# Altium project MB1019.PrjPCB (part 2 of 2)

## Sheet CAN&Humidity_Sensor&HB_LED&IR.SchDoc
size A4; Revision: C.2
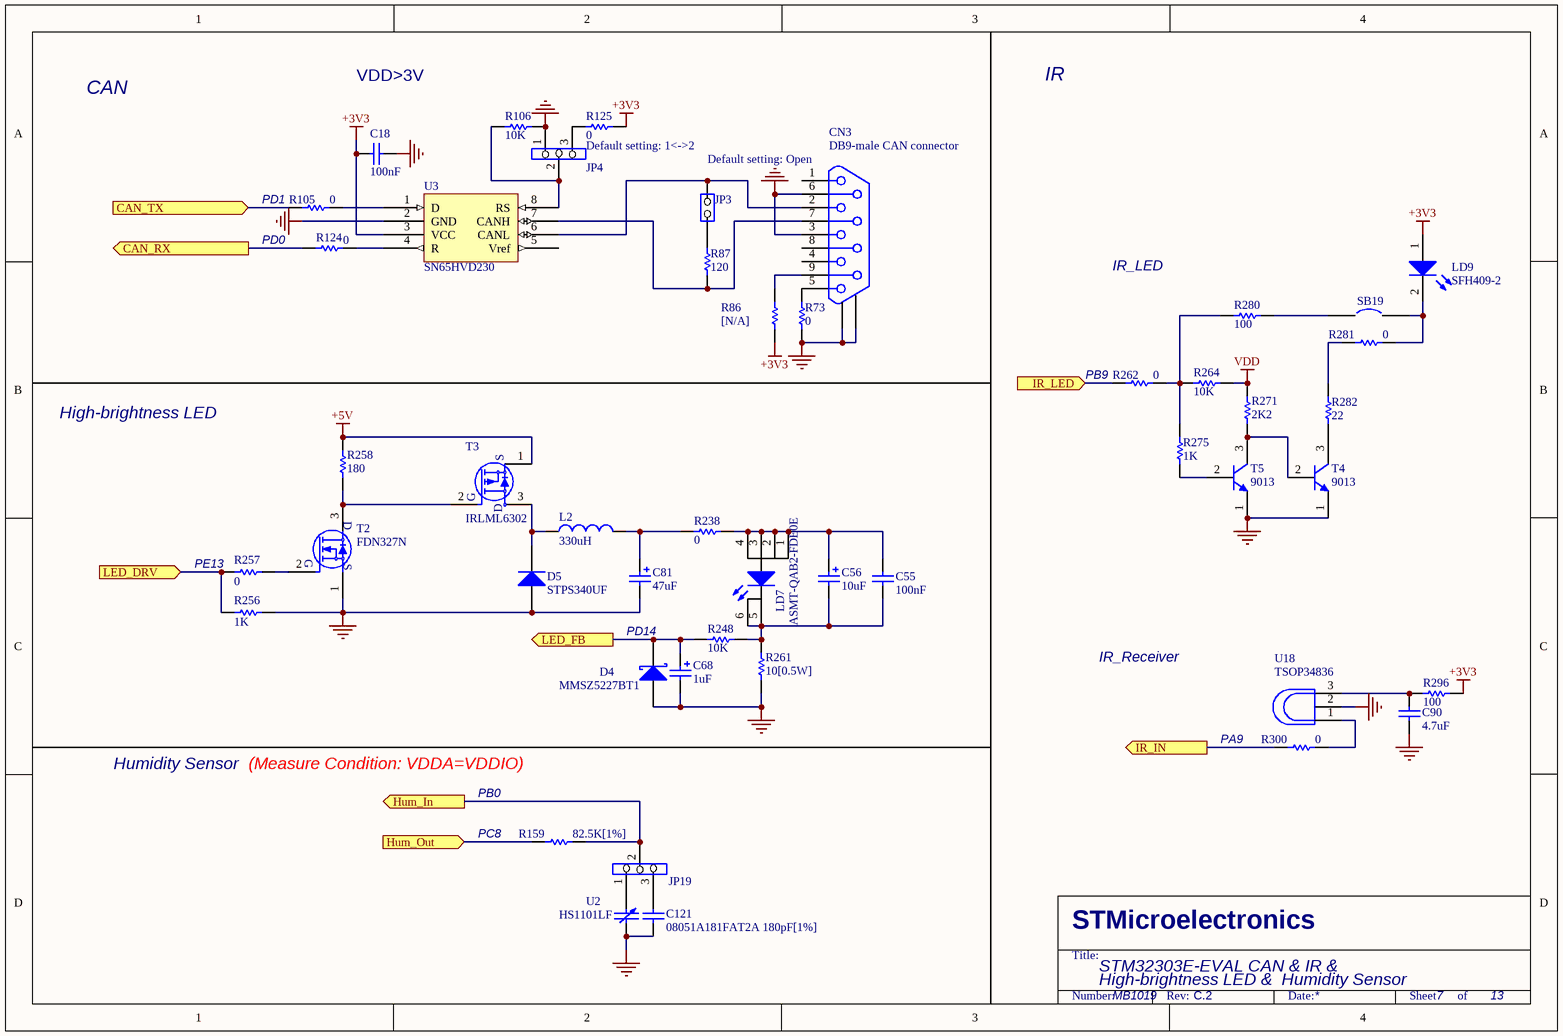
[diagram p6: CAN&Humidity_Sensor&HB_LED&IR.SchDoc]

### Parts
C18  100nF  [0603C]
C55  100nF  [0603C]
C56  10uF  [TAN-A]
C68  1uF  [TAN-A]
C81  47uF  [C200M]
C90  4.7uF  [0603C]
C121  08051A181FAT2A 180pF[1%]  [0805C]
CN3  DB9-male CAN connector  [DB9/M]
D4  MMSZ5227BT1  [SOD-123]
D5  STPS340UF  [SMB]
JP3  (no value)  [SIP2]
JP4  (no value)  [SIP3]
JP19  (no value)  [SIP3]
L2  330uH  [SLF10145]
LD7  ASMT-QAB2-FDE0E  [PLCC4]
LD9  SFH409-2  [D0.1L]
R73  0  [0603R]
R86  [N/A]  [0603R]
R87  120  [0603R]
R105  0  [0603R]
R106  10K  [0603R]
R124  0  [0603R]
R125  0  [0603R]
R159  82.5K[1%]  [0603R]
R238  0  [0603R]
R248  10K  [0603R]
R256  1K  [0603R]
R257  0  [0603R]
R258  180  [0603R]
R261  10[0.5W]  [2010R]
R262  0  [0603R]
R264  10K  [0603R]
R271  2K2  [0603R]
R275  1K  [0603R]
R280  100  [0603R]
R281  0  [0603R]
R282  22  [0603R]
R296  100  [0603R]
R300  0  [0603R]
SB19  (no value)  [JP2_SMD]
T2  FDN327N  [SOT-23]
T3  IRLML6302  [SOT-23]
T4  9013  [SOT-23]
T5  9013  [SOT-23]
U2  HS1101LF  [HS1101LF]
U3  SN65HVD230  [SO8]
U18  TSOP34836  [TSOP348]

### Ports
CAN_RX (out), CAN_TX (in), Hum_In (out), Hum_Out (in), IR_IN (out), IR_LED (in), LED_DRV (in), LED_FB (out)

### Nets
+3V3: C18.2 LD9.1(A) R86.1 R125.2 R296.2 U3.3(VCC)
+5V: R258.1 T3.1(S)
GND: C18.1 C68.2 C81.2 C90.2 C121.1 CN3.0 CN3.3 CN3.6 D4.1(A) D5.1(A) JP4.1 R73.1 R106.2 R256.1 R261.1 T2.1(S) T4.1(E) T5.1(E) U2.2 U3.2(GND) U18.2(GND)
VDD: R264.1 R271.2
PB9: R262.2 ; port IR_LED
PD0: R124.1 ; port CAN_RX
PD1: R105.2 ; port CAN_TX
NetC55_1: C55.1 C56.2 LD7.5(K) LD7.6(K) R248.2 R261.2
NetC55_2: C55.2 C56.1 LD7.1(A) LD7.2(A) LD7.3(A) LD7.4(A) R238.2
NetC68_1: C68.1 D4.2(K) R248.1 ; port LED_FB
NetC81_1: C81.1 L2.2 R238.1
NetC90_1: C90.1 R296.1 U18.3(Vs)
NetC121_2: C121.2 JP19.3
NetCN3_2: CN3.2 JP3.2(NO) U3.6(CANL)
NetCN3_5: CN3.5 R73.2
NetCN3_7: CN3.7 R87.1 U3.7(CANH)
NetCN3_9: CN3.9 R86.2
NetD5_2: D5.2(K) L2.1 T3.3(D)
NetJP3_1: JP3.1(COMMON) R87.2
NetJP4_2: JP4.2 R106.1 U3.8(RS)
NetJP4_3: JP4.3 R125.1
NetJP18_3: R300.1 ; port IR_IN
NetJP19_1: JP19.1 U2.1
NetJP19_2: JP19.2 R159.1 ; port Hum_In
NetLD9_2: LD9.2(K) R281.2 SB19.2
NetR32_1: R256.2 R257.1 ; port LED_DRV
NetR50_1: R159.2 ; port Hum_Out
NetR105_1: R105.1 U3.1(D)
NetR124_2: R124.2 U3.4(R)
NetR257_2: R257.2 T2.2(G)
NetR258_2: R258.2 T2.3(D) T3.2(G)
NetR262_1: R262.1 R264.2 R275.1 R280.2
NetR271_1: R271.1 T4.2(B) T5.3(C)
NetR275_2: R275.2 T5.2(B)
NetR280_1: R280.1 SB19.1
NetR281_1: R281.1 R282.2
NetR282_1: R282.1 T4.3(C)
NetR300_2: R300.2 U18.1(OUT)

Not connected (* = marked no-connect by the designer): CN3 1 4 8; U3 5(Vref)

### Notes on the sheet
- CAN
- VDD>3V
- IR
- Default setting: 1<->2
- (near CN3) Default setting: Open
- (near R105) PD1
- PD0
- IR_LED
- (near R262) PB9
- High-brightness LED
- (near R257) PE13
- PD14
- IR_Receiver
- Humidity Sensor
- (Measure Condition: VDDA=VDDIO)
- PA9
- PB0
- (near R159) PC8
- High-brightness LED &  Humidity Sensor
- STM32303E-EVAL CAN & IR &
- MB1019
- 7
- 13
- STMicroelectronics
- Title:
- Number:
- Rev:
- Date:
- Sheet       of

### Library data of the parts
C18 = CAP: Capacitor; Published: 8-Jun-2000; Revision: July-2002: Re-released for DXP Platform.; Publisher: Altium Limited; Value: 100nF
C55 C90 C121 = Cap: Capacitor; Value: 10nF; Published: 8-Jun-2000; Revision: July-2002: Re-released for DXP Platform.; Publisher: Altium Limited
C56 = Cap Pol1: Polarized Capacitor (Radial); Published: 8-Jun-2000; Revision: July-2002: Re-released for DXP Platform.; Publisher: Altium Limited; Value: 10uF
C68 C81 = Cap Pol1: Polarized Capacitor (Radial); Value: 10uF; Published: 8-Jun-2000; Revision: July-2002: Re-released for DXP Platform.; Publisher: Altium Limited
CN3 = DB9
D4 = D Schottky: Schottky Diode; Code - JEDEC: DO-214-AA; Published: 8-Jun-2000; Revision: July-2002: Re-released for DXP Platform.; Publisher: Altium Limited
D5 = STPS340: Default Diode; Code - JEDEC: DO-214-AB; Published: 8-Jun-2000; Revision: July-2002: Re-released for DXP Platform.; Publisher: Altium Limited
JP3 = JP2
JP4 JP19 = Jumper3
L2 = SLF10145T-331MR54-PF: Inductor; Value: 100uH; Published: 8-Jun-2000; Revision: July-2002: Re-released for DXP Platform.; Publisher: Altium Limited
LD7 = HB_LED: High brightness LED; Published: 8-Jun-2000; Revision: July-2002: Re-released for DXP Platform.; Publisher: Altium Limited
LD9 = LED2: as LD1 on sheet Peripherals; Published: 8-Jun-2000; Revision: July-2002: Re-released for DXP Platform.; Publisher: Altium Limited
R73 R86 R87 R105 R106 R125 R238 R248 R262 = res1: Resistor; Value: 1K; Published: 8-Jun-2000; Revision: July-2002: Re-released for DXP Platform.; Publisher: Altium Limited
R124 R159 R257 R258 R261 R264 R271 R280-R282 R296 R300 = Res1: Resistor; Value: 1K; Published: 8-Jun-2000; Revision: July-2002: Re-released for DXP Platform.; Publisher: Altium Limited
R256 R275 = Res1: Resistor; Published: 8-Jun-2000; Revision: July-2002: Re-released for DXP Platform.; Publisher: Altium Limited; Value: 1K
SB19 = Circuit Breaker: Published: 24-Mar-1999; Revision: July-2002: Re-released for DXP Platform.; Publisher: Altium Limited
T2 = 2N7000
T4 T5 = NPN: NPN Bipolar Transistor; Code - JEDEC: TO-226-AA; Published: 8-Jun-2000; Revision: July-2002: Re-released for DXP Platform.; Publisher: Altium Limited
U3 = SN65HVD230D
U18 = TSOP34838

## Sheet JTAG&Trace.SchDoc
size A4; Revision: C.2
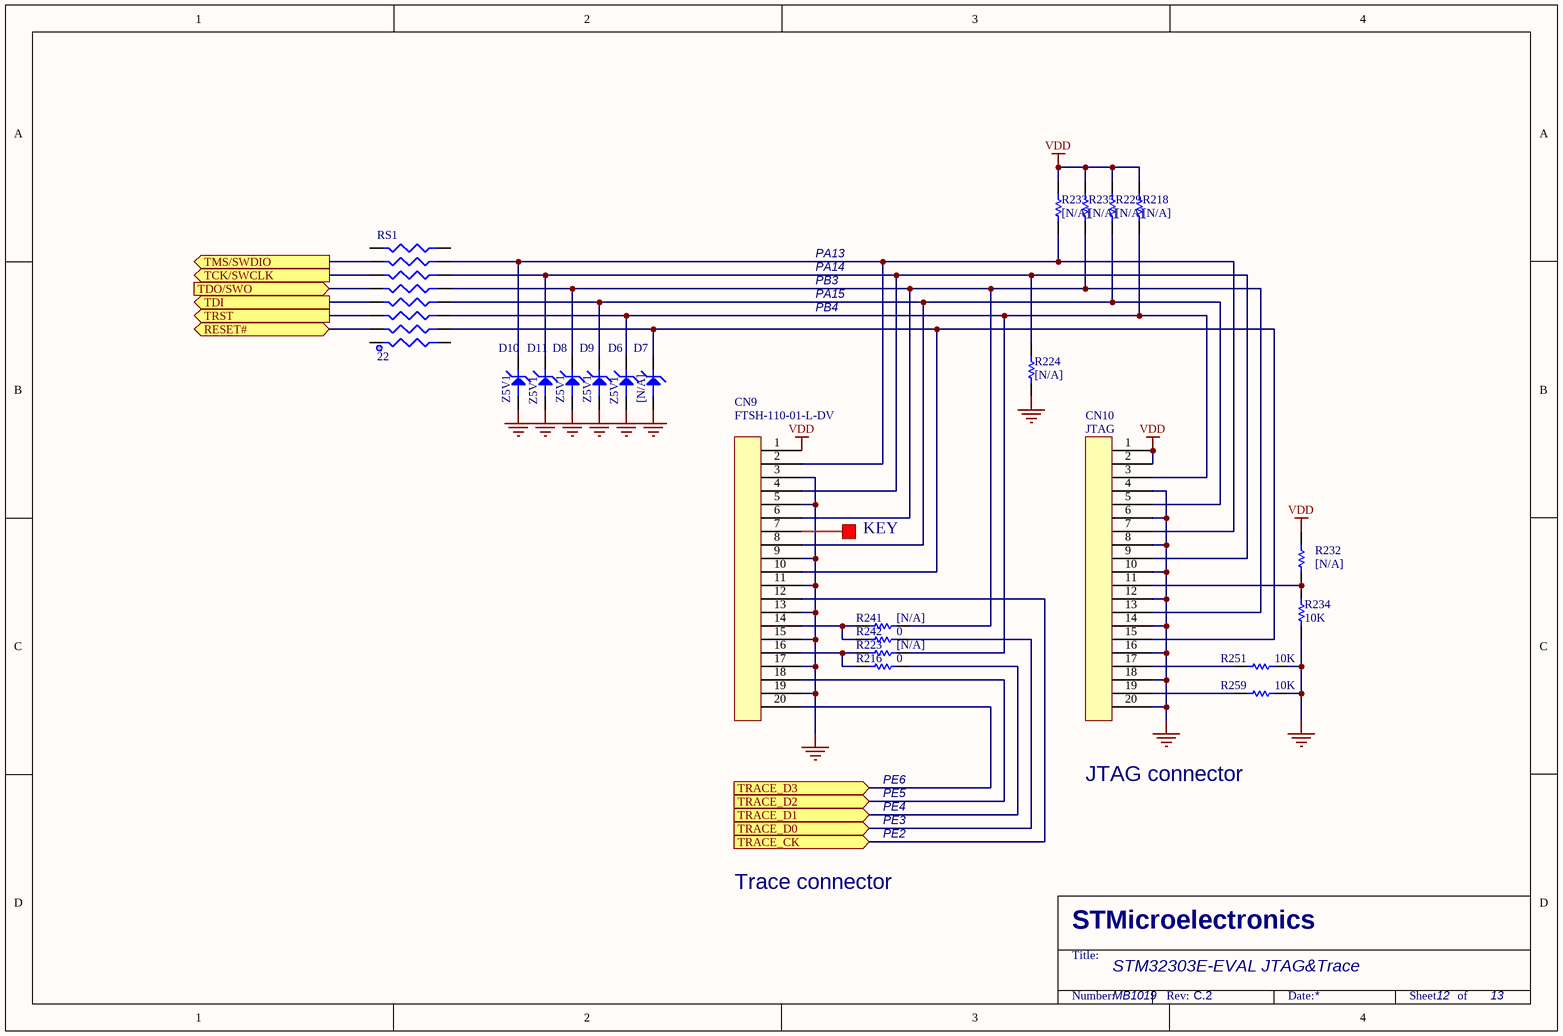
[diagram p7: JTAG&Trace.SchDoc]

### Parts
CN9  FTSH-110-01-L-DV  [FTSH-110-01-L-DV]
CN10  JTAG  [IDC20S]
D6  Z5V1  [SOT-23]
D7  [N/A]  [SOT-23]
D8  Z5V1  [SOT-23]
D9  Z5V1  [SOT-23]
D10  Z5V1  [SOT-23]
D11  Z5V1  [SOT-23]
R216  0  [0603R]
R218  [N/A]  [0603R]
R223  [N/A]  [0603R]
R224  [N/A]  [0603R]
R229  [N/A]  [0603R]
R232  [N/A]  [0603R]
R233  [N/A]  [0603R]
R234  10K  [0603R]
R235  [N/A]  [0603R]
R241  [N/A]  [0603R]
R242  0  [0603R]
R251  10K  [0603R]
R259  10K  [0603R]
RS1  22  [RES8B_0402]

### Ports
RESET# (bidir), TCK/SWCLK (out), TDI (out), TDO/SWO (in), TMS/SWDIO (out), TRACE_CK (in), TRACE_D0 (in), TRACE_D1 (in), TRACE_D2 (in), TRACE_D3 (in), TRST (out)

### Nets
GND: CN9.3 CN9.5 CN9.9 CN9.11 CN9.13 CN9.15 CN9.17 CN9.19 CN10.4 CN10.6 CN10.8 CN10.10 CN10.12 CN10.14 CN10.16 CN10.18 CN10.20 D6.2 D7.2 D8.2 D9.2 D10.2 D11.2 R224.1 R234.1 R251.1 R259.1
VDD: CN9.1 CN10.1 CN10.2 R218.2 R229.2 R232.2 R233.2 R235.2
PA13: RS1.13 ; port TMS/SWDIO
PA14: RS1.11 ; port TCK/SWCLK
PA15: RS1.7 ; port TDI
PB3: RS1.9 ; port TDO/SWO
PB4: RS1.5 ; port TRST
PE6: CN9.20 ; port TRACE_D3
RESET#: RS1.3 ; port RESET#
NetCN9_2: CN9.2 CN10.7 D10.3 R233.1 RS1.14
NetCN9_4: CN9.4 CN10.9 D11.3 R224.2 RS1.12
NetCN9_6: CN9.6 CN10.13 D8.3 R235.1 R241.2 RS1.10
NetCN9_8: CN9.8 CN10.5 D9.3 R229.1 RS1.8
NetCN9_10: CN9.10 CN10.15 D7.3 RS1.4
NetCN9_12: CN9.12 ; port TRACE_CK
NetCN9_14: CN9.14 R241.1 R242.1
NetCN9_16: CN9.16 R216.1 R223.1
NetCN9_18: CN9.18 ; port TRACE_D2
NetCN10_3: CN10.3 D6.3 R218.1 R223.2 RS1.6
NetCN10_11: CN10.11 R232.1 R234.2
NetCN10_17: CN10.17 R251.2
NetCN10_19: CN10.19 R259.2
NetR4_1: R242.2 ; port TRACE_D0
NetR6_1: R216.2 ; port TRACE_D1

Not connected (* = marked no-connect by the designer): CN9 7; RS1 1 2 15 16

### Notes on the sheet
- PA13
- PA14
- PB3
- PA15
- PB4
- KEY
- PE6
- JTAG connector
- PE5
- PE4
- PE3
- PE2
- Trace connector
- STM32303E-EVAL JTAG&Trace
- MB1019
- 12
- 13
- STMicroelectronics
- Title:
- Number:
- Rev:
- Date:
- Sheet       of

### Library data of the parts
CN9 CN10 = 20PIN1
D6-D11 = BATS5V6
R216 R218 R223 R224 R229 R232-R235 R241 R242 R251 R259 = Res1: Resistor; Value: 1K; Published: 8-Jun-2000; Revision: July-2002: Re-released for DXP Platform.; Publisher: Altium Limited
RS1 = RES8B

## Sheet ST_LINK.SCHDOC
size A4; Revision: C.2
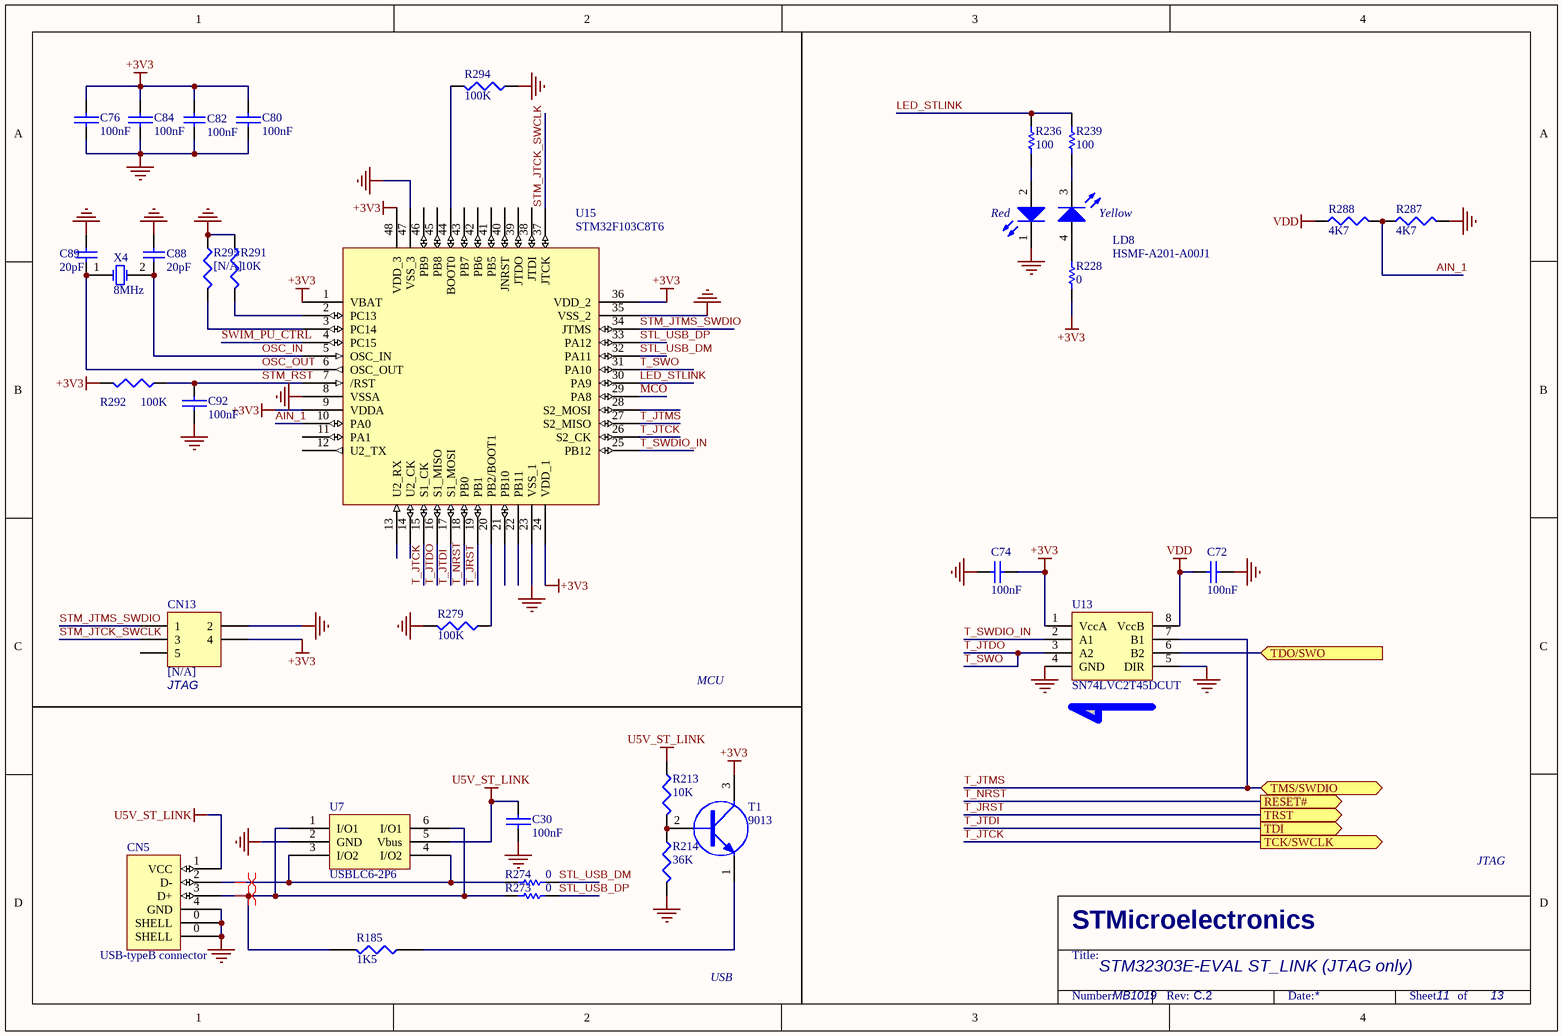
[diagram p8: ST_LINK.SCHDOC]

### Parts
C30  100nF  [0603C]
C72  100nF  [0603C]
C74  100nF  [0603C]
C76  100nF  [0603C]
C80  100nF  [0603C]
C82  100nF  [0603C]
C84  100nF  [0603C]
C88  20pF  [0603C]
C89  20pF  [0603C]
C92  100nF  [0603C]
CN5  USB-typeB connector  [USB-B]
CN13  [N/A]  [2*3P]
LD8  HSMF-A201-A00J1  [LED2-28*32]
R185  1K5  [0603R]
R213  10K  [0603R]
R214  36K  [0603R]
R228  0  [0603R]
R236  100  [0603R]
R239  100  [0603R]
R273  0  [0603R]
R274  0  [0603R]
R279  100K  [0603R]
R287  4K7  [0603R]
R288  4K7  [0603R]
R291  10K  [0603R]
R292  100K  [0603R]
R294  100K  [0603R]
R295  [N/A]  [0603R]
T1  9013  [SOT-23]
U7  USBLC6-2P6  [SOT-666]
U13  SN74LVC2T45DCUT  [VSSOP8]
U15  STM32F103C8T6  [LQFP48]
X4  8MHz  [SMT_XTAL]

### Ports
RESET# (out), TCK/SWCLK (out), TDI (out), TDO/SWO (in), TMS/SWDIO (bidir), TRST (out)

### Nets
+3V3: C74.2 C76.2 C80.2 C82.1 C84.2 CN13.4 R228.2 R292.2 T1.3(C) U13.1(VccA) U15.1(VBAT) U15.9(VDDA) U15.24(VDD_1) U15.36(VDD_2) U15.48(VDD_3)
GND: C30.2 C72.2 C74.1 C76.1 C80.1 C82.2 C84.1 C88.1 C89.1 C92.1 CN5.0(SHELL) CN5.4(GND) CN13.2 LD8.1(RED_cathode) R214.2 R279.2 R287.2 R291.1 R294.1 R295.1 U7.2(GND) U13.4(GND) U13.5(DIR) U15.8(VSSA) U15.23(VSS_1) U15.35(VSS_2) U15.47(VSS_3)
U5V_ST_LINK: C30.1 CN5.1(VCC) R213.1 U7.5(Vbus)
VDD: C72.1 R288.1 U13.8(VccB)
AIN_1: R287.1 R288.2 U15.10(PA0)
LED_STLINK: R236.1 R239.1 U15.30(PA9)
MCO: U15.29(PA8)
OSC_IN: C88.2 U15.5(OSC_IN) X4.2(OSC2)
OSC_OUT: C89.2 U15.6(OSC_OUT) X4.1(OSC1)
PB3: U13.6(B2) ; port TDO/SWO
STL_USB_DM: R274.1 U15.32(PA11)
STL_USB_DP: R273.1 U15.33(PA12)
STM_JTCK_SWCLK: CN13.3 U15.37(JTCK)
STM_JTMS_SWDIO: CN13.1 U15.34(JTMS)
STM_RST: C92.2 R292.1 U15.7(/RST)
SWIM_PU_CTRL: U15.4(PC15)
T_JRST: U15.19(PB1) ; port TRST  [project net PB4]
T_JTCK: U15.15(S1_CK) U15.26(S2_CK) ; port TCK/SWCLK  [project net PA14]
T_JTDI: U15.17(S1_MOSI) ; port TDI  [project net PA15]
T_JTDO: U13.3(A2) U15.16(S1_MISO) U15.31(PA10)  [also labelled T_SWO]
T_JTMS: U13.7(B1) U15.27(S2_MISO) ; port TMS/SWDIO  [project net PA13]
T_NRST: U15.18(PB0) ; port RESET#  [project net RESET#]
T_SWDIO_IN: U13.2(A1) U15.25(PB12)
NetCN5_2: CN5.2(D-) R274.2 U7.3(I/O2) U7.4(I/O2)
NetCN5_3: CN5.3(D+) R185.2 R273.2 U7.1(I/O1) U7.6(I/O1)
NetLD8_2: LD8.2(Red_anode) R236.2
NetLD8_3: LD8.3(YellowGreen_cathode) R239.2
NetLD8_4: LD8.4(YellowGreen_anode) R228.1
NetR185_1: R185.1 T1.1(E)
NetR213_2: R213.2 R214.1 T1.2(B)
NetR279_1: R279.1 U15.20(PB2/BOOT1)
NetR291_2: R291.2 U15.2(PC13)
NetR294_2: R294.2 U15.44(BOOT0)
NetR295_2: R295.2 U15.3(PC14)

Not connected (* = marked no-connect by the designer): CN13 5; U15 11(PA1) 12(U2_TX) 13(U2_RX) 14(U2_CK) 21(PB10) 22(PB11) 28(S2_MOSI) 38(JTDI) 39(JTDO) 40(JNRST) 41(PB5) 42(PB6) 43(PB7) 45(PB8) 46(PB9)

### Layout directives
differential pair: NetCN5_2, NetCN5_3

### Notes on the sheet
- (near CN13) JTAG
- MCU
- JTAG
- USB
- STM32303E-EVAL ST_LINK (JTAG only)
- MB1019
- 11
- 13
- STMicroelectronics
- Title:
- Number:
- Rev:
- Date:
- Sheet       of
- (in symbol HSMF-A201-A00J1) Red; Yellow

### Library data of the parts
C30 = CAP: Capacitor
C72 C74 = CAP: Capacitor; Value: 100pF; Published: 8-Jun-2000; Revision: July-2002: Re-released for DXP Platform.; Publisher: Altium Limited
C76 C80 C84 C92 = CAP
C82 = Cap: Capacitor; Value: 10nF; Published: 8-Jun-2000; Revision: July-2002: Re-released for DXP Platform.; Publisher: Altium Limited
C88 C89 = Cap: Capacitor; Published: 8-Jun-2000; LatestRevisionDate: 17-Jul-2002; LatestRevisionNote: Re-released for DXP Platform.; PackageReference: RAD-0.3; Publisher: Altium Limited; Value: 20pF
CN13 = Header 3X2: Header, 3-Pin, Dual row; Revision: 17-Jul-2002: Re-released for DXP Platform.; Publisher: Altium Limited
R185 R279 R287 R288 R292 R294 = RES1
R213 R214 R291 R295 = R: Right: 20; Bottom: 30
R228 R236 R239 R273 R274 = Res1: Resistor; Value: 1K; Published: 8-Jun-2000; Revision: July-2002: Re-released for DXP Platform.; Publisher: Altium Limited
T1 = NPN
U7 = USBLC6-2
U15 = STM32F10x(48pin)
X4 = XTAL: Crystal Oscillator; Published: 8-Jun-2000; LatestRevisionDate: 17-Jul-2002; LatestRevisionNote: Re-released for DXP Platform.; PackageReference: R38; Publisher: Altium Limited

## Sheet Power.SchDoc
size A4; Revision: C.2
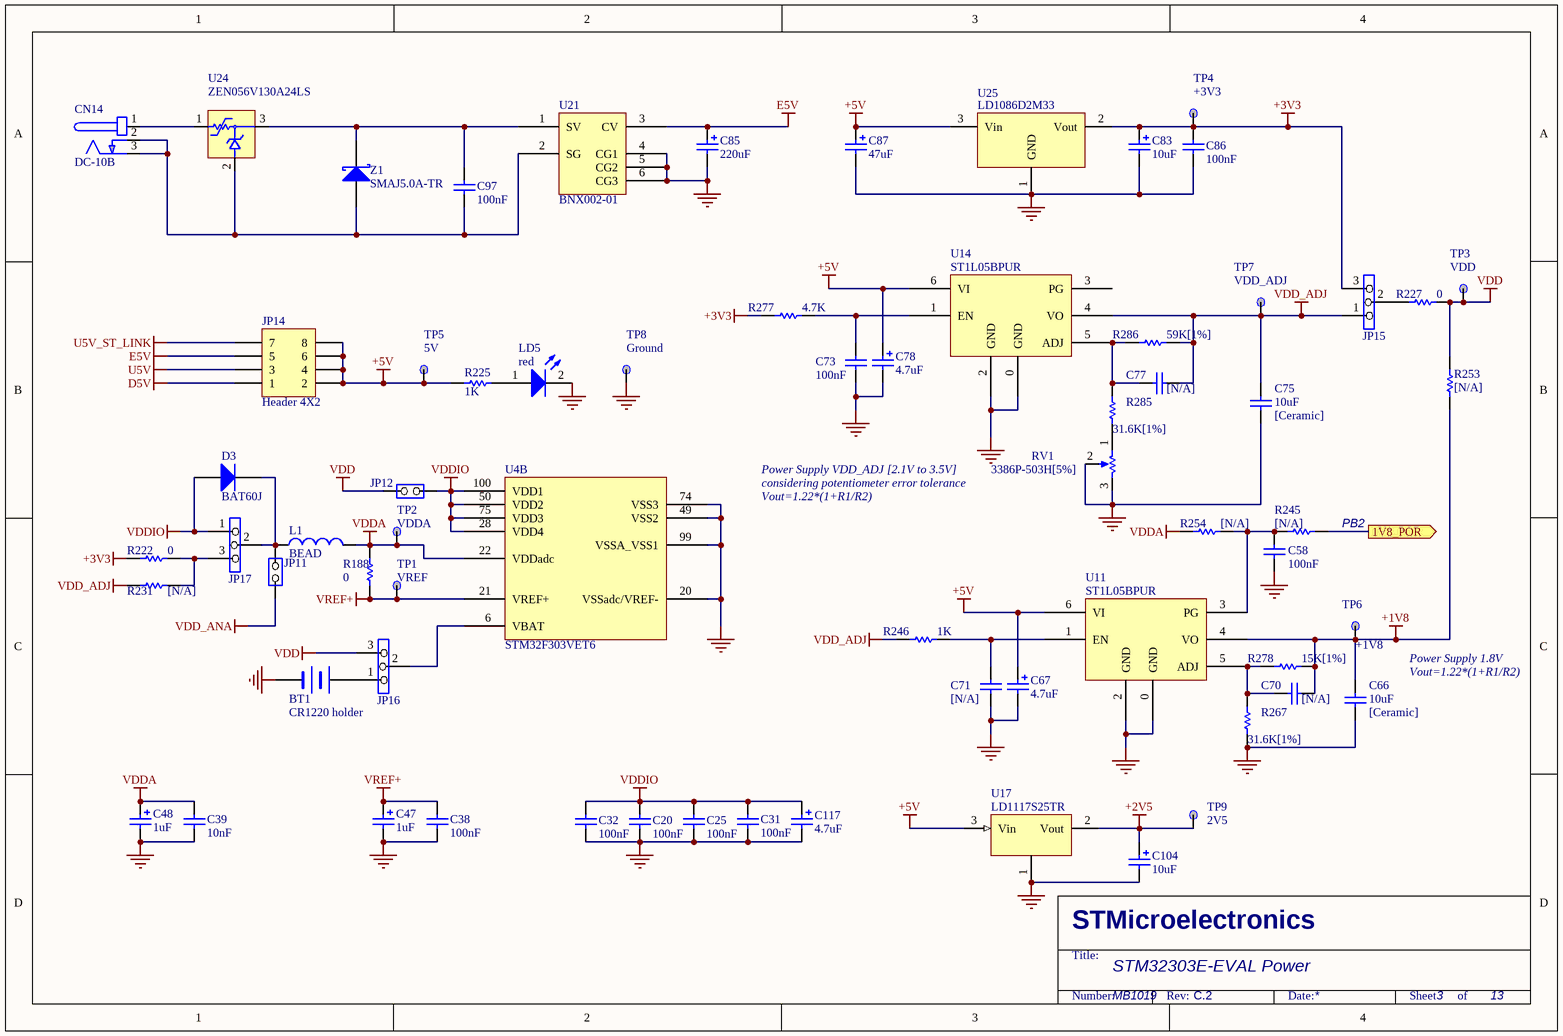
[diagram p9: Power.SchDoc]

### Parts
BT1  CR1220 holder  [LI1220_1]
C20  100nF  [0603C]
C25  100nF  [0603C]
C31  100nF  [0603C]
C32  100nF  [0603C]
C38  100nF  [0603C]
C39  10nF  [0603C]
C47  1uF  [TAN-A]
C48  1uF  [TAN-A]
C58  100nF  [0603C]
C66  10uF  [0805C]
C67  4.7uF  [TAN-A]
C70  [N/A]  [0603C]
C71  [N/A]  [0603C]
C73  100nF  [0603C]
C75  10uF  [0805C]
C77  [N/A]  [0603C]
C78  4.7uF  [TAN-A]
C83  10uF  [TAN-A]
C85  220uF  [C310M]
C86  100nF  [0603C]
C87  47uF  [C200M]
C97  100nF  [0603C]
C104  10uF  [TAN-A]
C117  4.7uF  [TAN-A]
CN14  DC-10B  [DC10B]
D3  BAT60J  [SOD-323]
JP11  (no value)  [SIP2]
JP12  (no value)  [SIP2]
JP14  Header 4X2  [2*4P]
JP15  (no value)  [SIP3]
JP16  (no value)  [SIP3]
JP17  (no value)  [SIP3]
L1  BEAD  [0603L]
LD5  red  [0603D]
R188  0  [0603R]
R222  0  [0603R]
R225  1K  [0603R]
R227  0  [0603R]
R231  [N/A]  [0603R]
R245  [N/A]  [0603R]
R246  1K  [0603R]
R253  [N/A]  [0603R]
R254  [N/A]  [0603R]
R267  31.6K[1%]  [0603R]
R277  4.7K  [0603R]
R278  15K[1%]  [0603R]
R285  31.6K[1%]  [0603R]
R286  59K[1%]  [0603R]
RV1  3386P-503H[5%]  [3296W]
TP1  VREF  [TP]
TP2  VDDA  [TP]
TP3  VDD  [TP]
TP4  +3V3  [TP]
TP5  5V  [TP]
TP6  +1V8  [TP]
TP7  VDD_ADJ  [TP]
TP8  Ground  [TP]
TP9  2V5  [TP]
U4  STM32F303VET6  [IC149-100-025-B5]  (part B of 2)
U11  ST1L05BPUR  [DFN6(3X3)]
U14  ST1L05BPUR  [DFN6(3X3)]
U17  LD1117S25TR  [SOT-223]
U21  BNX002-01  [BNX001]
U24  ZEN056V130A24LS  [polyzen]
U25  LD1086D2M33  [D2PAK/A]
Z1  SMAJ5.0A-TR  [1R1C]

### Ports
1V8_POR (out)

### Nets
+1V8: C66.1 C70.2 R253.2 R278.1 TP6.1 U11.4(VO)
+2V5: C104.1 TP9.1 U17.2(Vout)
+3V3: C83.1 C86.1 JP15.3 R222.2 R277.2 TP4.1 U25.2(Vout)
+5V: C67.1 C78.1 C87.1 JP14.2 JP14.4 JP14.6 JP14.8 R225.2 TP5.1 U11.6(VI) U14.6(VI) U17.3(Vin) U25.3(Vin)
D5V: JP14.1
E5V: C85.1 JP14.5 U21.3(CV)
GND: BT1.2(-) C20.2 C25.2 C31.1 C32.2 C38.1 C39.1 C47.2 C48.2 C58.2 C66.2 C67.2 C71.2 C73.2 C75.2 C78.2 C83.2 C85.2 C86.2 C87.2 C104.2 C117.2 LD5.2(K) R267.2 RV1.2(TAP) RV1.3(TOP) TP8.1 U4.20(VSSadc/VREF-) U4.49(VSS2) U4.74(VSS3) U4.99(VSSA_VSS1) U11.0(GND) U11.2(GND) U14.0(GND) U14.2(GND) U17.1 U21.4(CG1) U21.5(CG2) U21.6(CG3) U25.1(GND)
U5V: JP14.3
U5V_ST_LINK: JP14.7
VDD: JP12.2(NO) JP16.3 R227.1 R253.1 TP3.1
VDD_ADJ: C75.1 C77.2 JP15.1 R231.2 R246.2 R286.1 TP7.1 U14.4(VO)
VDD_ANA: JP11.1(COMMON)
VDDA: C39.2 C48.1 L1.2 R188.1 R254.1 TP2.1 U4.22(VDDadc)
VDDIO: C20.1 C25.1 C31.2 C32.1 C117.1 D3.1(A) JP12.1(COMMON) JP17.1 U4.28(VDD4) U4.50(VDD2) U4.75(VDD3) U4.100(VDD1)
VREF+: C38.2 C47.1 R188.2 TP1.1 U4.21(VREF+)
PB2: R245.1 ; port 1V8_POR
NetBT1_1: BT1.1(+) JP16.1
NetC58_1: C58.1 R245.2 R254.2 U11.3(PG)
NetC70_1: C70.1 R267.1 R278.2 U11.5(ADJ)
NetC71_1: C71.1 R246.1 U11.1(EN)
NetC73_1: C73.1 R277.1 U14.1(EN)
NetC77_1: C77.1 R285.1 R286.2 U14.5(ADJ)
NetC97_1: C97.1 U21.1(SV) U24.3 Z1.2(K)
NetC97_2: C97.2 CN14.2(GND) CN14.3(GND) U21.2(SG) U24.2 Z1.1(A)
NetCN14_1: CN14.1(+) U24.1
NetD3_2: D3.2(K) JP11.2(NO) JP17.2 L1.1
NetJP15_2: JP15.2 R227.2
NetJP16_2: JP16.2 U4.6(VBAT)
NetJP17_3: JP17.3 R222.1 R231.1
NetLD5_1: LD5.1(A) R225.1
NetR285_2: R285.2 RV1.1(BOT)

Not connected (* = marked no-connect by the designer): U14 3(PG)

### Notes on the sheet
- (near C75) [Ceramic]
- Power Supply VDD_ADJ [2.1V to 3.5V]
- Vout=1.22*(1+R1/R2)
- considering potentiometer error tolerance
- (near R245) PB2
- (near C66) [Ceramic]
- Power Supply 1.8V
- STM32303E-EVAL Power
- MB1019
- 3
- 13
- STMicroelectronics
- Title:
- Number:
- Rev:
- Date:
- Sheet       of

### Library data of the parts
BT1 = BATTERY
C20 C25 C32 = CAP: Capacitor; Published: 8-Jun-2000; Revision: July-2002: Re-released for DXP Platform.; Publisher: Altium Limited; Value: 100nF
C31 C38 C58 C66 C70 C71 C73 C75 C77 C86 = Cap: Capacitor; Value: 10nF; Published: 8-Jun-2000; Revision: July-2002: Re-released for DXP Platform.; Publisher: Altium Limited
C39 = Cap: Capacitor; Published: 8-Jun-2000; Revision: July-2002: Re-released for DXP Platform.; Publisher: Altium Limited; Value: 10nF
C47 C48 C87 = Cap Pol1: Polarized Capacitor (Radial); Value: 10uF; Published: 8-Jun-2000; Revision: July-2002: Re-released for DXP Platform.; Publisher: Altium Limited
C67 C78 C117 = Cap Pol1: Polarized Capacitor (Radial); Value: 100pF; Published: 8-Jun-2000; Revision: July-2002: Re-released for DXP Platform.; Publisher: Altium Limited
C83 C104 = Cap Pol1: Polarized Capacitor (Radial); Published: 8-Jun-2000; Revision: July-2002: Re-released for DXP Platform.; Publisher: Altium Limited; Value: 10uF
C85 = Cap Pol1: Polarized Capacitor (Radial); Value: 47uF; Published: 8-Jun-2000; Revision: July-2002: Re-released for DXP Platform.; Publisher: Altium Limited
C97 = CAP: Capacitor; Value: 100pF; Published: 8-Jun-2000; Revision: July-2002: Re-released for DXP Platform.; Publisher: Altium Limited
CN14 = PJ202A
D3 = Diode: Default Diode; Code - JEDEC: DO-214-AB; Published: 8-Jun-2000; Revision: July-2002: Re-released for DXP Platform.; Publisher: Altium Limited
JP11 JP12 = JP2
JP14 = Header 4X2: Header, 4-Pin, Dual row; Revision: 17-Jul-2002: Re-released for DXP Platform.; Publisher: Altium Limited
JP15-JP17 = Jumper3
L1 = Inductor: Value: 100uH; Published: 8-Jun-2000; Revision: July-2002: Re-released for DXP Platform.; Publisher: Altium Limited
LD5 = LED2: Typical RED, GREEN, YELLOW, AMBER GaAs LED; Published: 8-Jun-2000; Revision: July-2002: Re-released for DXP Platform.; Publisher: Altium Limited
R188 R222 R227 R231 R245 R253 R267 R278 R285 R286 = Res1: Resistor; Value: 1K; Published: 8-Jun-2000; Revision: July-2002: Re-released for DXP Platform.; Publisher: Altium Limited
R225 R246 = res1: Resistor; Published: 8-Jun-2000; Revision: July-2002: Re-released for DXP Platform.; Publisher: Altium Limited; Value: 1K
R254 R277 = res1: Resistor; Value: 1K; Published: 8-Jun-2000; Revision: July-2002: Re-released for DXP Platform.; Publisher: Altium Limited
RV1 = RV
TP1-TP9 = TP
U4 = STM32F303VCT6
U11 U14 = ST1L05
U17 = LD1117
U21 = BNX002
U25 = VOLTREG1
Z1 = D Schottky: Schottky Diode; Code - JEDEC: DO-214-AA; Published: 8-Jun-2000; Revision: July-2002: Re-released for DXP Platform.; Publisher: Altium Limited

## Sheet Audio.SchDoc
size A4; Revision: C.2
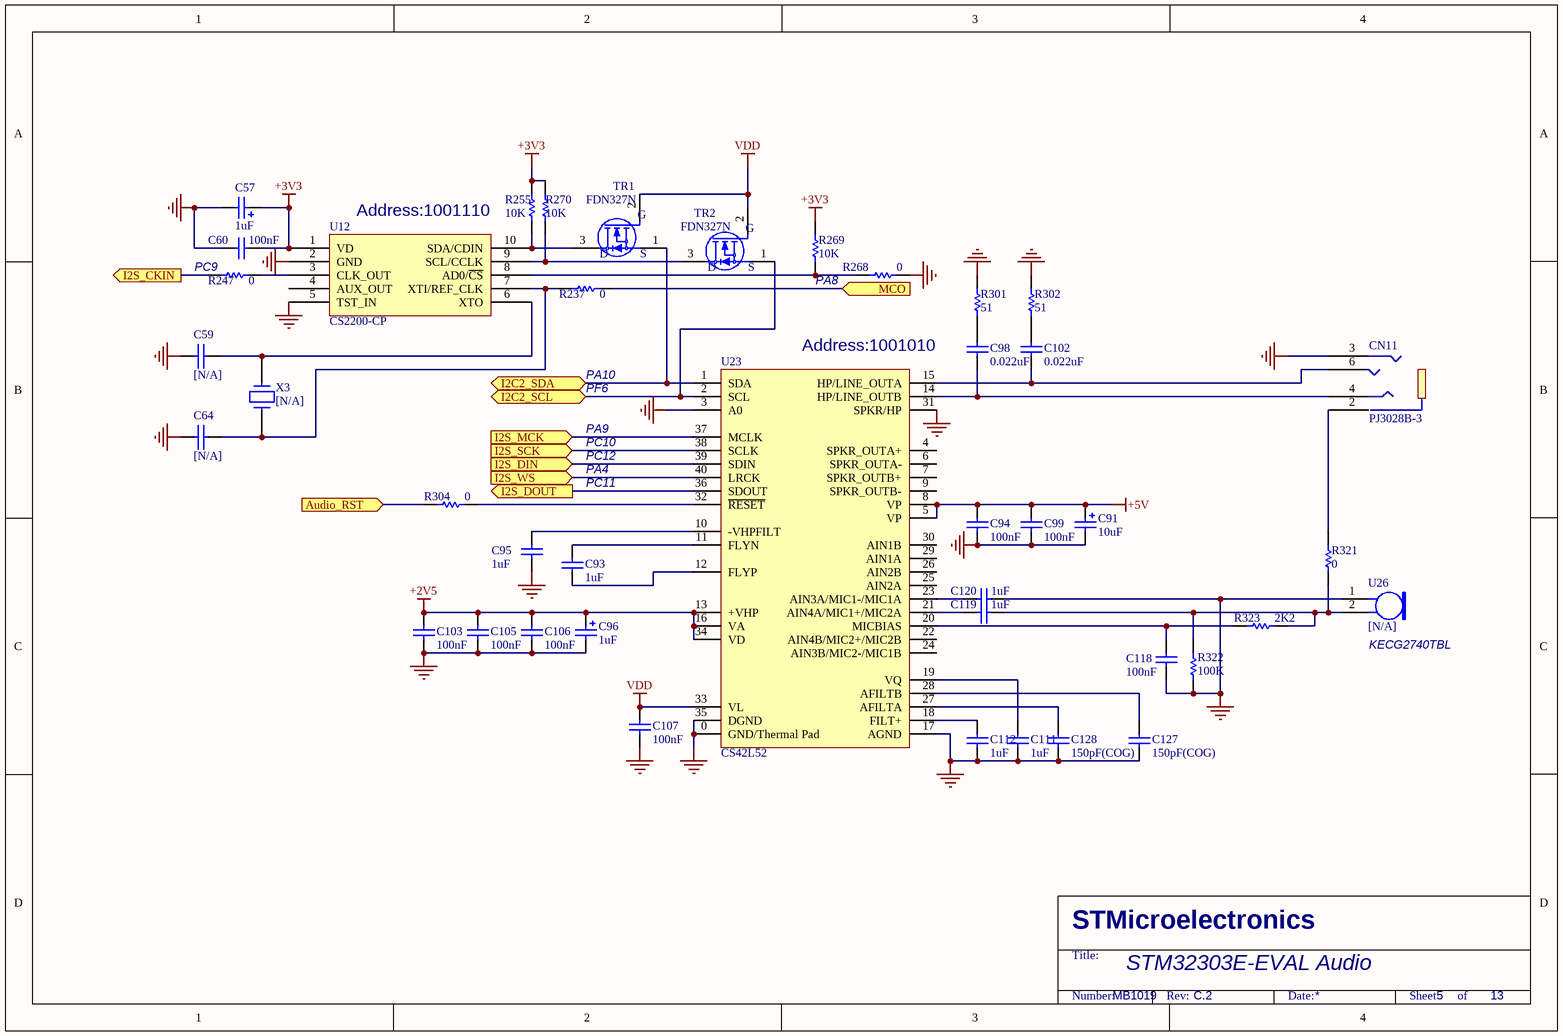
[diagram p10: Audio.SchDoc]

### Parts
C57  1uF  [TAN-A]
C59  [N/A]  [0603C]
C60  100nF  [0603C]
C64  [N/A]  [0603C]
C91  10uF  [TAN-A]
C93  1uF  [0603C]
C94  100nF  [0603C]
C95  1uF  [0603C]
C96  1uF  [TAN-A]
C98  0.022uF  [0603C]
C99  100nF  [0603C]
C102  0.022uF  [0603C]
C103  100nF  [0603C]
C105  100nF  [0603C]
C106  100nF  [0603C]
C107  100nF  [0603C]
C111  1uF  [0603C]
C112  1uF  [0603C]
C118  100nF  [0603C]
C119  1uF  [0603C]
C120  1uF  [0603C]
C127  150pF(COG)  [0603C]
C128  150pF(COG)  [0603C]
CN11  PJ3028B-3  [PJ3028B]
R237  0  [0603R]
R247  0  [0603R]
R255  10K  [0603R]
R268  0  [0603R]
R269  10K  [0603R]
R270  10K  [0603R]
R301  51  [0603R]
R302  51  [0603R]
R304  0  [0603R]
R321  0  [0603R]
R322  100K  [0603R]
R323  2K2  [0603R]
TR1  FDN327N  [SOT-23]
TR2  FDN327N  [SOT-23]
U12  CS2200-CP  [MSOP10(0.5)]
U23  CS42L52  [QFN40(6*6)]
U26  [N/A]  [KEC2740]
X3  [N/A]  [XTAL_socket]

### Ports
Audio_RST (in), I2C2_SCL (bidir), I2C2_SDA (bidir), I2S_CKIN (out), I2S_DIN (in), I2S_DOUT (out), I2S_MCK (in), I2S_SCK (in), I2S_WS (in), MCO (in)

### Nets
+2V5: C96.1 C103.1 C105.1 C106.1 U23.13(+VHP) U23.16(VA) U23.34(VD)
+3V3: C57.1 C60.1 R255.1 R269.1 R270.1 U12.1(VD)
+5V: C91.1 C94.1 C99.1 U23.5(VP) U23.8(VP)
GND: C57.2 C59.2 C60.2 C64.2 C91.2 C94.2 C95.2 C96.2 C99.2 C103.2 C105.2 C106.2 C107.2 C111.1 C112.1 C118.2 C120.2 C127.1 C128.1 CN11.3 R268.1 R301.1 R302.1 R322.2 U12.2(GND) U12.5(TST_IN) U23.0(GND/Thermal_Pad) U23.3(A0) U23.17(AGND) U23.31(SPKR/HP) U23.35(DGND) U26.1
VDD: C107.1 TR1.2(G) TR2.2(G) U23.33(VL)
PA8: R237.1 ; port MCO
PC9: R247.2 ; port I2S_CKIN
RESET#: R304.2 ; port Audio_RST
NetC59_1: C59.1 U12.6(XTO) X3.2
NetC64_1: C64.1 R237.2 U12.7(XTI/REF_CLK) X3.1
NetC93_1: C93.1 U23.12(FLYP)
NetC93_2: C93.2 U23.11(FLYN)
NetC95_1: C95.1 U23.10(-VHPFILT)
NetC98_1: C98.1 R301.2
NetC98_2: C98.2 CN11.4 U23.14(HP/LINE_OUTB)
NetC102_1: C102.1 R302.2
NetC102_2: C102.2 CN11.6 U23.15(HP/LINE_OUTA)
NetC111_2: C111.2 U23.19(VQ)
NetC112_2: C112.2 U23.18(FILT+)
NetC118_1: C118.1 R323.2 U23.20(MICBIAS)
NetC119_1: C119.1 U23.21(AIN4A/MIC1+/MIC2A)
NetC119_2: C119.2 R321.1 R322.1 R323.1 U26.2
NetC120_1: C120.1 U23.23(AIN3A/MIC1-/MIC1A)
NetC127_2: C127.2 U23.28(AFILTB)
NetC128_2: C128.2 U23.27(AFILTA)
NetCN11_2: CN11.2 R321.2
NetJP5_1: TR1.1(S) U23.1(SDA) ; port I2C2_SDA
NetJP6_1: TR2.1(S) U23.2(SCL) ; port I2C2_SCL
NetJP18_1: U23.37(MCLK) ; port I2S_MCK
NetR16_2: U23.40(LRCK) ; port I2S_WS
NetR52_1: U23.38(SCLK) ; port I2S_SCK
NetR54_1: U23.36(SDOUT) ; port I2S_DOUT
NetR56_1: U23.39(SDIN) ; port I2S_DIN
NetR247_1: R247.1 U12.3(CLK_OUT)
NetR255_2: R255.2 TR1.3(D) U12.10(SDA/CDIN)
NetR268_2: R268.2 R269.2 U12.8(AD0/~{CS})
NetR270_2: R270.2 TR2.3(D) U12.9(SCL/CCLK)
NetR304_1: R304.1 U23.32(~{RESET})

Not connected (* = marked no-connect by the designer): U12 4(AUX_OUT); U23 4(SPKR_OUTA+) 6(SPKR_OUTA-) 7(SPKR_OUTB+) 9(SPKR_OUTB-) 22(AIN4B/MIC2+/MIC2B) 24(AIN3B/MIC2-/MIC1B) 25(AIN2A) 26(AIN2B) 29(AIN1A) 30(AIN1B)

### Notes on the sheet
- (near U12) Address:1001110
- (near R247) PC9
- (near R269) PA8
- PA10
- (near U23) Address:1001010
- PA9
- PC10
- PF6
- PA4
- PC12
- PC11
- (near U26) KECG2740TBL
- STM32303E-EVAL Audio
- MB1019
- 5
- 13
- STMicroelectronics
- Title:
- Number:
- Rev:
- Date:
- Sheet       of

### Library data of the parts
C57 C96 = Cap Pol1: as C85 on sheet Power; Published: 8-Jun-2000; Revision: July-2002: Re-released for DXP Platform.; Publisher: Altium Limited
C59 C60 C64 = CAP: Capacitor
  C60: Published: 8-Jun-2000; Revision: July-2002: Re-released for DXP Platform.; Publisher: Altium Limited; Value: 100nF
C91 = Cap Pol1: Polarized Capacitor (Radial); Published: 8-Jun-2000; Revision: July-2002: Re-released for DXP Platform.; Publisher: Altium Limited; Value: 10uF
C93 C95 C98 C102 C111 C112 C119 C120 C127 C128 = CAP: Capacitor; Value: 100nF; Published: 8-Jun-2000; Revision: July-2002: Re-released for DXP Platform.; Publisher: Altium Limited
C94 C99 C103 C105-C107 C118 = Cap: Capacitor; Value: 10nF; Published: 8-Jun-2000; Revision: July-2002: Re-released for DXP Platform.; Publisher: Altium Limited
R237 R268 R301 R302 R321 R322 = res1: Resistor; Value: 1K; Published: 8-Jun-2000; Revision: July-2002: Re-released for DXP Platform.; Publisher: Altium Limited
R247 R255 R269 R270 R304 R323 = Res1: Resistor; Value: 1K; Published: 8-Jun-2000; Revision: July-2002: Re-released for DXP Platform.; Publisher: Altium Limited
TR1 TR2 = 2N7000
U26 = Mic2: Microphone; Published: 24-Mar-1999; Revision: July-2002: Re-released for DXP Platform.; Publisher: Altium Limited
X3 = CRYSTAL

## Sheet I2C Peripherals.SCHDOC
size A4; Revision: C.2
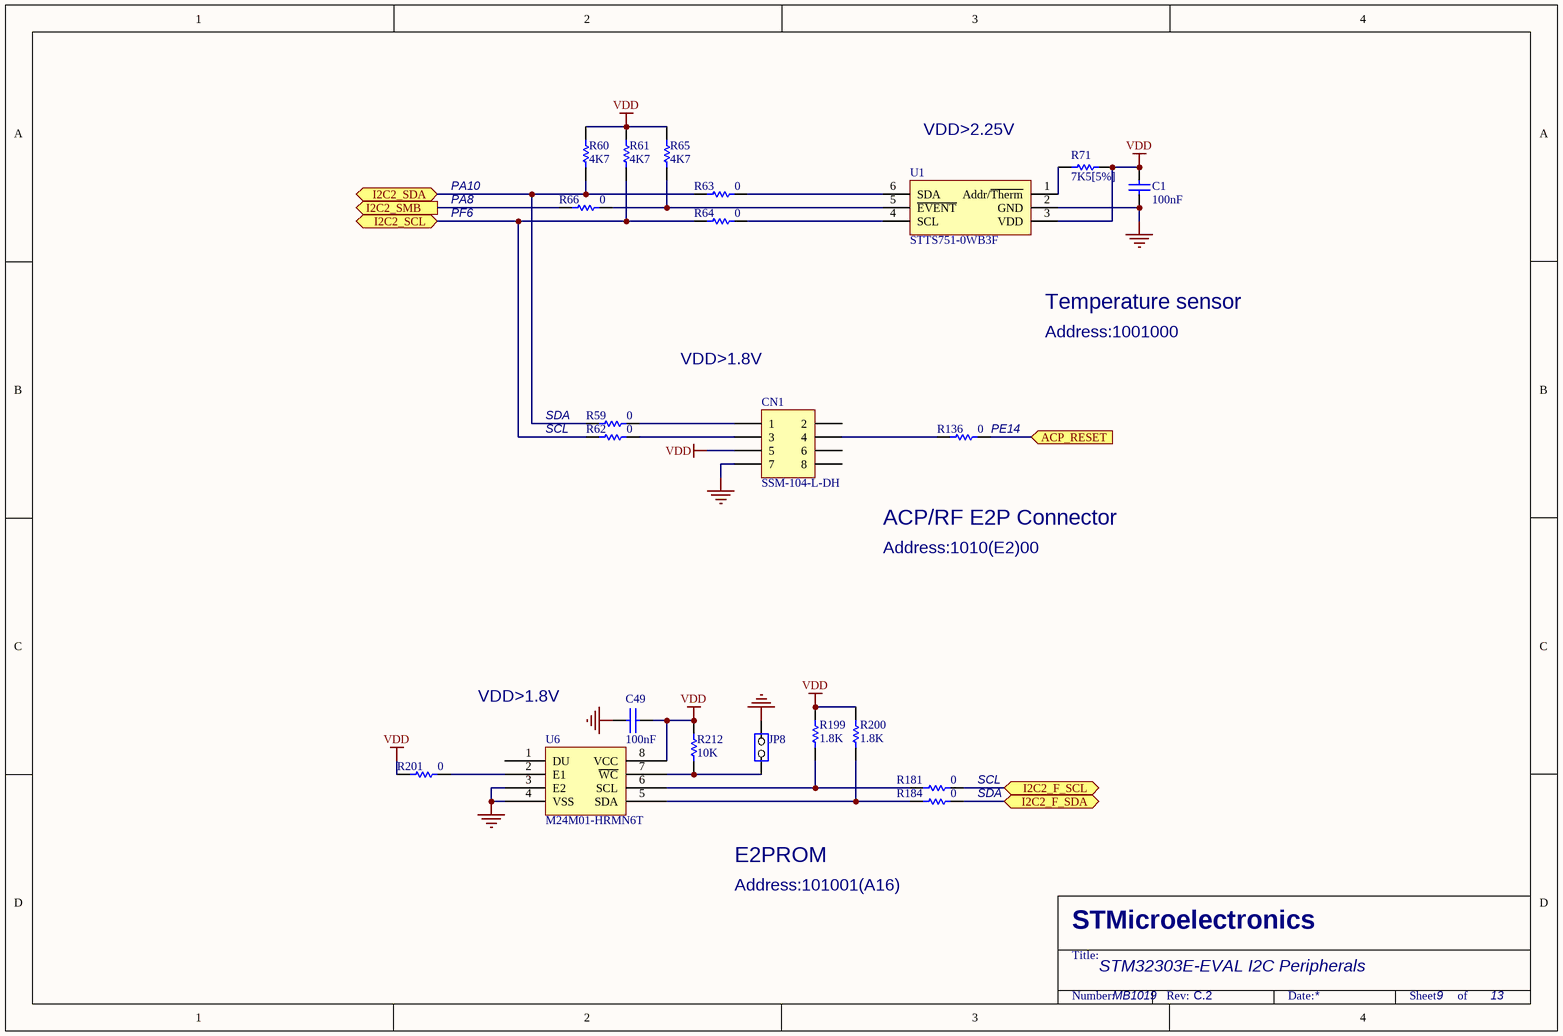
[diagram p11: I2C Peripherals.SCHDOC]

### Parts
C1  100nF  [0603C]
C49  100nF  [0603C]
CN1  SSM-104-L-DH  [SSM-104-L-DH]
JP8  (no value)  [SIP2]
R59  0  [0603R]
R60  4K7  [0603R]
R61  4K7  [0603R]
R62  0  [0603R]
R63  0  [0603R]
R64  0  [0603R]
R65  4K7  [0603R]
R66  0  [0603R]
R71  7K5[5%]  [0603R]
R136  0  [0603R]
R181  0  [0603R]
R184  0  [0603R]
R199  1.8K  [0603R]
R200  1.8K  [0603R]
R201  0  [0603R]
R212  10K  [0603R]
U1  STTS751-0WB3F  [SOT23-6L]
U6  M24M01-HRMN6T  [SO8]

### Ports
ACP_RESET (in), I2C2_F_SCL (bidir), I2C2_F_SDA (bidir), I2C2_SCL (bidir), I2C2_SDA (bidir), I2C2_SMB (out)

### Nets
GND: C1.1 C49.1 CN1.7 JP8.2(NO) U1.2(GND) U6.3(E2) U6.4(VSS)
VDD: C1.2 C49.2 CN1.5 R60.2 R61.2 R65.2 R71.1 R199.2 R200.2 R201.1 R212.1 U1.3(VDD) U6.8(VCC)
PE14: R136.1 ; port ACP_RESET
NetCN1_1: CN1.1 R59.2
NetCN1_3: CN1.3 R62.2
NetCN1_4: CN1.4 R136.2
NetJP1_2: R66.2 ; port I2C2_SMB
NetJP5_1: R59.1 R60.1 R63.1 ; port I2C2_SDA
NetJP5_3: R184.2 ; port I2C2_F_SDA
NetJP6_1: R61.1 R62.1 R64.1 ; port I2C2_SCL
NetJP6_3: R181.2 ; port I2C2_F_SCL
NetJP8_1: JP8.1(COMMON) R212.2 U6.7(~{WC})
NetR63_2: R63.2 U1.6(SDA)
NetR64_2: R64.2 U1.4(SCL)
NetR65_1: R65.1 R66.1 U1.5(~{EVENT})
NetR71_2: R71.2 U1.1(Addr/~{Therm})
NetR181_1: R181.1 R199.1 U6.6(SCL)
NetR184_1: R184.1 R200.1 U6.5(SDA)
NetR201_2: R201.2 U6.2(E1)

Not connected (* = marked no-connect by the designer): CN1 2 6 8; U6 1(DU)

### Notes on the sheet
- VDD>2.25V
- PA10
- PA8
- PF6
- Temperature sensor
- VDD>1.8V
- Address:1001000
- SDA
- SCL
- (near R136) PE14
- Address:1010(E2)00
- ACP/RF E2P Connector
- Address:101001(A16)
- E2PROM
- STM32303E-EVAL I2C Peripherals
- MB1019
- 9
- 13
- STMicroelectronics
- Title:
- Number:
- Rev:
- Date:
- Sheet       of

### Library data of the parts
C1 = cap: Capacitor; Value: 100pF; Published: 8-Jun-2000; Revision: July-2002: Re-released for DXP Platform.; Publisher: Altium Limited
C49 = CAP: Capacitor
CN1 = SSM-104-L-DH: Header, 5-Pin, Dual row; Revision: 17-Jul-2002: Re-released for DXP Platform.; Publisher: Altium Limited
JP8 = JP2
R59-R66 R71 R136 R181 R184 R199-R201 = Res1: Resistor; Value: 1K; Published: 8-Jun-2000; Revision: July-2002: Re-released for DXP Platform.; Publisher: Altium Limited
R212 = res1: Resistor; Value: 1K; Published: 8-Jun-2000; Revision: July-2002: Re-released for DXP Platform.; Publisher: Altium Limited
U6 = M24M01

## Sheet LCD_MicroSD_Flash.SchDoc
size A4; Revision: C.2
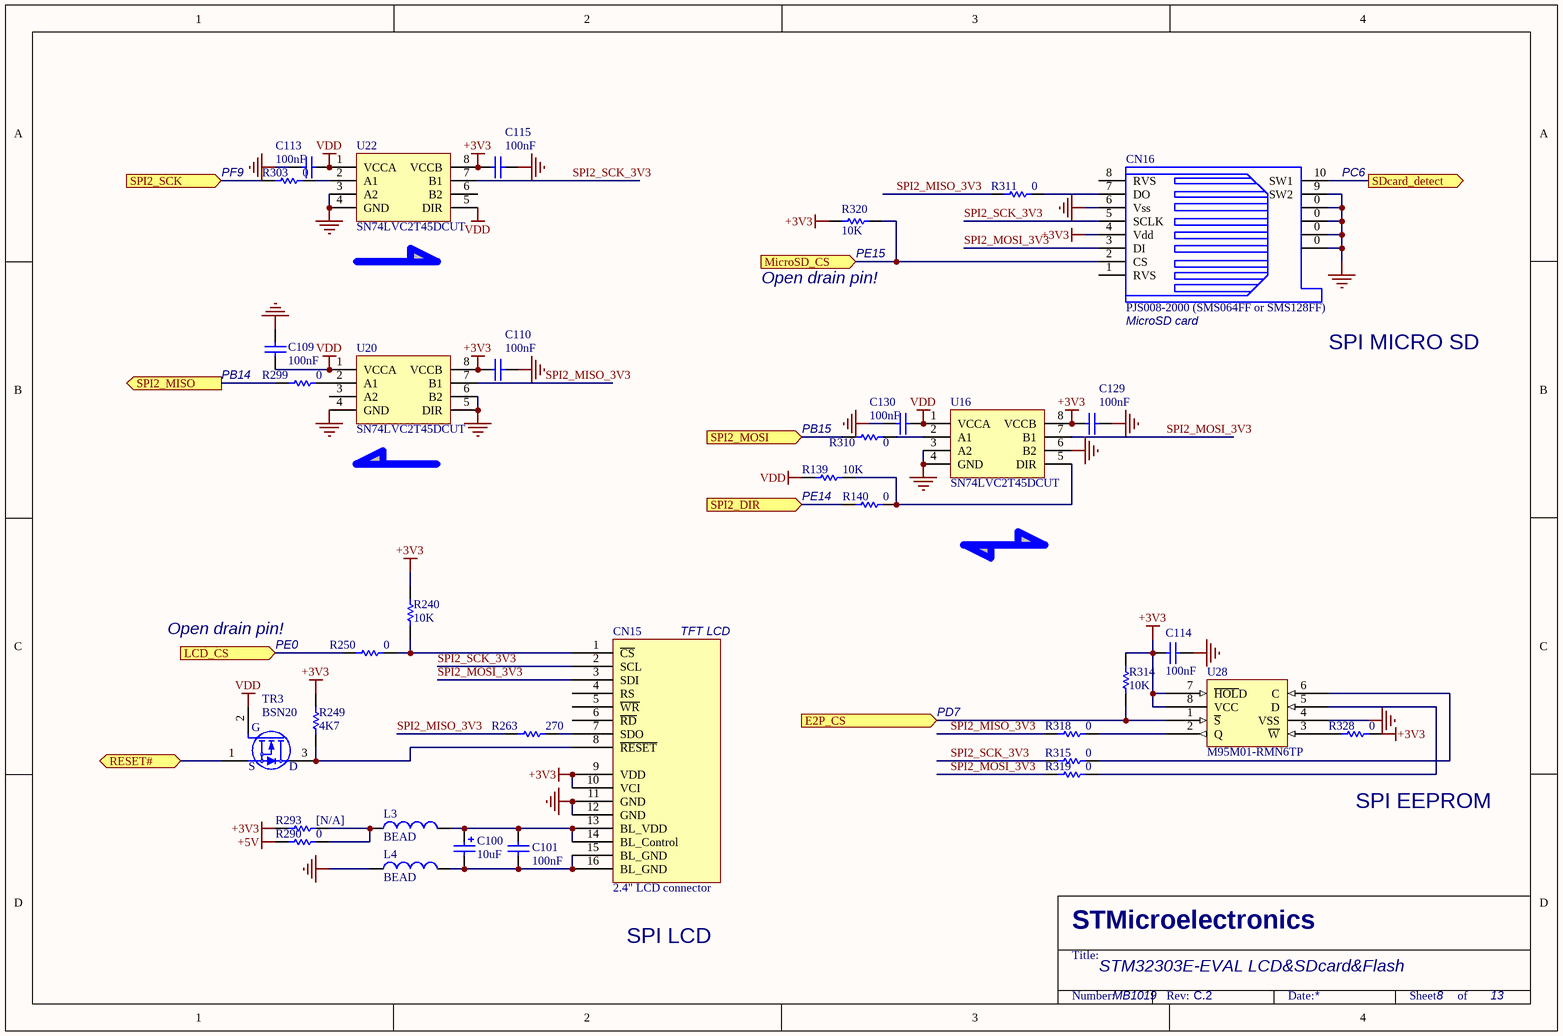
[diagram p12: LCD_MicroSD_Flash.SchDoc]

### Parts
C100  10uF  [TAN-A]
C101  100nF  [0603C]
C109  100nF  [0603C]
C110  100nF  [0603C]
C113  100nF  [0603C]
C114  100nF  [0603C]
C115  100nF  [0603C]
C129  100nF  [0603C]
C130  100nF  [0603C]
CN15  2.4" LCD connector  [MB895CS]
CN16  PJS008-2000 (SMS064FF or SMS128FF)  [MSD(PJS008)]
L3  BEAD  [0603L]
L4  BEAD  [0603L]
R139  10K  [0603R]
R140  0  [0603R]
R240  10K  [0603R]
R249  4K7  [0603R]
R250  0  [0603R]
R263  270  [0603R]
R290  0  [0603R]
R293  [N/A]  [0603R]
R299  0  [0603R]
R303  0  [0603R]
R310  0  [0603R]
R311  0  [0603R]
R314  10K  [0603R]
R315  0  [0603R]
R318  0  [0603R]
R319  0  [0603R]
R320  10K  [0603R]
R328  0  [0603R]
TR3  BSN20  [SOT-23]
U16  SN74LVC2T45DCUT  [VSSOP8]
U20  SN74LVC2T45DCUT  [VSSOP8]
U22  SN74LVC2T45DCUT  [VSSOP8]
U28  M95M01-RMN6TP  [SO8]

### Ports
E2P_CS (in), LCD_CS (in), MicroSD_CS (in), RESET# (bidir), SDcard_detect (out), SPI2_DIR (in), SPI2_MISO (out), SPI2_MOSI (in), SPI2_SCK (in)

### Nets
+3V3: C110.2 C114.1 C115.2 C129.2 CN15.9(VDD) CN15.10(VCI) CN16.4(Vdd) R240.2 R249.2 R293.1 R314.1 R320.2 R328.1 U16.8(VCCB) U20.8(VCCB) U22.8(VCCB) U28.7(~{HOL}D) U28.8(VCC)
+5V: R290.1
GND: C109.1 C110.1 C113.1 C114.2 C115.1 C129.1 C130.1 CN15.11(GND) CN15.12(GND) CN16.0 CN16.6(Vss) CN16.9(SW2) L4.1 U16.3(A2) U16.4(GND) U16.6(B2) U20.4(GND) U20.5(DIR) U20.6(B2) U22.3(A2) U22.4(GND) U28.4(VSS)
VDD: C109.2 C113.2 C130.2 R139.2 TR3.2(G) U16.1(VCCA) U20.1(VCCA) U22.1(VCCA) U22.5(DIR)
PB14: R299.1 ; port SPI2_MISO
PB15: R310.2 ; port SPI2_MOSI
PE0: R250.1 ; port LCD_CS
PE14: R140.2 ; port SPI2_DIR
PF9: R303.2 ; port SPI2_SCK
RESET#: TR3.1(S) ; port RESET#
SPI2_MISO_3V3: R263.1 R311.1 R318.2 U20.7(B1)
SPI2_MOSI_3V3: CN15.3(SDI) CN16.3(DI) R319.2 U16.7(B1)
SPI2_SCK_3V3: CN15.2(SCL) CN16.5(SCLK) R315.2 U22.7(B1)
NetC100_1: C100.1 C101.1 CN15.13(BL_VDD) CN15.14(BL_Control) L3.2
NetC100_2: C100.2 C101.2 CN15.15(BL_GND) CN15.16(BL_GND) L4.2
NetCN15_1: CN15.1(~{CS}) R240.1 R250.2
NetCN15_7: CN15.7(SDO) R263.2
NetCN15_8: CN15.8(~{RESET}) R249.1 TR3.3(D)
NetCN16_2: CN16.2(CS) R320.1 ; port MicroSD_CS
NetCN16_7: CN16.7(DO) R311.2
NetCN16_10: CN16.10(SW1) ; port SDcard_detect
NetL3_1: L3.1 R290.2 R293.2
NetR58_1: R314.2 U28.1(~{S}) ; port E2P_CS
NetR139_1: R139.1 R140.1 U16.5(DIR)
NetR299_2: R299.2 U20.2(A1)
NetR303_1: R303.1 U22.2(A1)
NetR310_1: R310.1 U16.2(A1)
NetR315_1: R315.1 U28.6(C)
NetR318_1: R318.1 U28.2(Q)
NetR319_1: R319.1 U28.5(D)
NetR328_2: R328.2 U28.3(~{W})

Not connected (* = marked no-connect by the designer): CN15 4(RS) 5(~{WR}) 6(~{RD}); CN16 1(RVS) 8(RVS); U20 3(A2); U22 6(B2)

### Notes on the sheet
- (near R303) PF9
- (near CN16) PC6
- (near R320) Open drain pin!
- (near R320) PE15
- PB14
- (near CN16) MicroSD card
- SPI MICRO SD
- PB15
- (near R139) PE14
- Open drain pin!
- PE0
- TFT LCD
- PD7
- SPI EEPROM
- SPI LCD
- STM32303E-EVAL LCD&SDcard&Flash
- MB1019
- 8
- 13
- STMicroelectronics
- Title:
- Number:
- Rev:
- Date:
- Sheet       of

### Library data of the parts
C100 = Cap Pol1: Polarized Capacitor (Radial); Published: 8-Jun-2000; Revision: July-2002: Re-released for DXP Platform.; Publisher: Altium Limited; Value: 10uF
C101 C114 = Cap: Capacitor; Value: 10nF; Published: 8-Jun-2000; Revision: July-2002: Re-released for DXP Platform.; Publisher: Altium Limited
C109 C110 C113 C115 C129 C130 = CAP: Capacitor; Value: 100pF; Published: 8-Jun-2000; Revision: July-2002: Re-released for DXP Platform.; Publisher: Altium Limited
CN15 = ColorLCD_module
CN16 = SMS016AFA5E
L3 L4 = Inductor: Value: 100uH; Published: 8-Jun-2000; Revision: July-2002: Re-released for DXP Platform.; Publisher: Altium Limited
R139 R140 R240 R249 R250 R263 R290 R293 R299 R311 R315 R318-R320 R328 = Res1: Resistor; Value: 1K; Published: 8-Jun-2000; Revision: July-2002: Re-released for DXP Platform.; Publisher: Altium Limited
R303 R310 R314 = res1: Resistor; Value: 1K; Published: 8-Jun-2000; Revision: July-2002: Re-released for DXP Platform.; Publisher: Altium Limited
TR3 = 2N7000
U28 = M95040-R

## Nets that join several sheets
+2V5: Power (C104.1 TP9.1 U17.2), Audio (7 pins)
+3V3: MCU (CN6.48), MotorCtrl (10 pins), RS232_RS485_IrDA (12 pins), Peripherals (LD1.1 LD2.1 LD3.1 LD4.1), CAN&Humidity_Sensor&HB_LED&IR (6 pins), ST_LINK (15 pins), Power (7 pins), Audio (6 pins), LCD_MicroSD_Flash (18 pins)
+5V: MotorCtrl (CN2.25 CN4.25), CAN&Humidity_Sensor&HB_LED&IR (R258.1 T3.1), Power (13 pins), Audio (5 pins), LCD_MicroSD_Flash (R290.1)
D5V: MCU (CN6.49 CN7.19), Power (JP14.1)
GND: MCU (19 pins), MotorCtrl (45 pins), RS232_RS485_IrDA (19 pins), Touch Sensing (C24.1 C52.1), Peripherals (19 pins), CAN&Humidity_Sensor&HB_LED&IR (21 pins), JTAG&Trace (27 pins), ST_LINK (27 pins), Power (40 pins), Audio (32 pins), I2C Peripherals (7 pins), LCD_MicroSD_Flash (22 pins)
U5V: Peripherals (C63.1 CN12.1 R283.1 U19.5), Power (JP14.3)
U5V_ST_LINK: ST_LINK (C30.1 CN5.1 R213.1 U7.5), Power (JP14.7)
VDD: MCU (CN7.24 SW1.1), RS232_RS485_IrDA (5 pins), Peripherals (R276.2 R312.2 R326.1 T6.3), CAN&Humidity_Sensor&HB_LED&IR (R264.1 R271.2), JTAG&Trace (8 pins), ST_LINK (C72.1 R288.1 U13.8), Power (5 pins), Audio (C107.1 TR1.2 TR2.2 U23.33), I2C Peripherals (13 pins), LCD_MicroSD_Flash (9 pins)
VDD_ANA: Peripherals (R158.2 RV2.1), Power (JP11.1)
GND_E: MCU (CN7.41 U4.27), MotorCtrl (C8.1 R82.2)
MC1_MC2_PFC_Ind: MCU (CN7.12 U4.55), MotorCtrl (C22.2 C23.2 R119.1 R123.1)
MC1_MC2_PFC_SD: MCU (CN6.23 U4.83), MotorCtrl (R153.1 R165.1)
MC1_MC2_PFC_Vac: MCU (CN7.7 U4.56), MotorCtrl (C7.2 C26.2 R80.1 R146.1)
MC1_MC2_PFCpwm: MCU (R3.1), MotorCtrl (R145.2 R148.2)
MC1_MC2_PFCsync: MCU (R1.1), MotorCtrl (R81.2 R147.2)
NetC2_2: MCU (R33.1), MotorCtrl (C2.2 CN2.1 R72.1)
NetC3_1: MCU (R9.2), MotorCtrl (C3.1 R67.1)
NetC13_2: MCU (R57.1), MotorCtrl (C13.2 CN2.34)
NetC14_1: MCU (R13.1), MotorCtrl (C14.1 R91.1)
NetC19_2: MCU (R11.2), MotorCtrl (C19.2 CN4.26)
NetC21_1: MCU (R37.2), MotorCtrl (C21.1 R131.1)
NetC27_2: MCU (R41.1), MotorCtrl (C27.2 CN4.33)
NetC28_2: MCU (R17.2), MotorCtrl (C28.2 CN4.34)
NetC29_2: MCU (R21.2), MotorCtrl (C29.2 R133.2 R135.2)
NetC52_2: MCU (R40.1), Touch Sensing (C52.2 SB8.2)
NetC68_1: MCU (R46.1), CAN&Humidity_Sensor&HB_LED&IR (C68.1 D4.2 R248.1)
NetC133_1: MCU (R45.1), MotorCtrl (C133.1 R90.2 R94.1)
NetC134_1: MCU (R35.2), MotorCtrl (C134.1 R128.1 R138.2)
NetC136_1: MCU (R19.2), MotorCtrl (C136.1 R108.2 R120.1)
NetCN2_3: MCU (R25.1), MotorCtrl (CN2.3)
NetCN2_5: MCU (R23.1), MotorCtrl (CN2.5)
NetCN2_7: MCU (R29.1), MotorCtrl (CN2.7)
NetCN2_9: MCU (R27.1), MotorCtrl (CN2.9)
NetCN2_11: MCU (R31.1), MotorCtrl (CN2.11)
NetCN2_21: MCU (R5.1), MotorCtrl (CN2.21)
NetCN2_23: MCU (R7.1), MotorCtrl (CN2.23)
NetCN4_3: MCU (R47.1), MotorCtrl (CN4.3)
NetCN4_5: MCU (R51.1), MotorCtrl (CN4.5)
NetCN4_9: MCU (R53.1), MotorCtrl (CN4.9)
NetCN4_11: MCU (R49.1), MotorCtrl (CN4.11)
NetCN4_13: MCU (R55.1), MotorCtrl (CN4.13)
NetCN4_21: MCU (R43.1), MotorCtrl (CN4.21)
NetCN6_51: MCU (CN6.51), Touch Sensing (SB11.1)
NetCN6_52: MCU (CN6.52), Touch Sensing (SB9.1)
NetCN7_2: MCU (CN7.2), Touch Sensing (SB7.1)
NetCN7_4: MCU (CN7.4), Touch Sensing (SB6.1)
NetCN7_6: MCU (CN7.6), Touch Sensing (SB8.1)
NetCN9_12: MCU (R2.1), JTAG&Trace (CN9.12)
NetCN9_18: MCU (R8.1), JTAG&Trace (CN9.18)
NetCN16_2: MCU (R34.1), LCD_MicroSD_Flash (CN16.2 R320.1)
NetCN16_10: MCU (R48.1), LCD_MicroSD_Flash (CN16.10)
NetD2_1: MCU (D2.1), RS232_RS485_IrDA (R202.1)
NetJP1_2: MCU (JP1.2), I2C Peripherals (R66.2)
NetJP5_1: MB1019 (JP5.1 R183.1), Audio (TR1.1 U23.1), I2C Peripherals (R59.1 R60.1 R63.1)
NetJP5_3: MB1019 (JP5.3 R182.1), I2C Peripherals (R184.2)
NetJP6_1: MB1019 (JP6.1 R180.1), Audio (TR2.1 U23.2), I2C Peripherals (R61.1 R62.1 R64.1)
NetJP6_3: MB1019 (JP6.3 R179.1), I2C Peripherals (R181.2)
NetJP10_2: MCU (JP10.2), RS232_RS485_IrDA (R215.1)
NetJP18_1: MCU (JP18.1), Audio (U23.37)
NetJP18_3: MCU (JP18.3), CAN&Humidity_Sensor&HB_LED&IR (R300.1)
NetJP19_2: MCU (R20.2), CAN&Humidity_Sensor&HB_LED&IR (JP19.2 R159.1)
NetPG3SA_2: MCU (R15.2), MotorCtrl (PG3SA.2 PGM1.3 PGM1.6)
NetR4_1: MCU (R4.1), JTAG&Trace (R242.2)
NetR6_1: MCU (R6.1), JTAG&Trace (R216.2)
NetR10_2: MCU (R10.2), Peripherals (R158.1 R164.2)
NetR14_1: MCU (R14.1), Peripherals (RV2.2)
NetR16_2: MCU (R16.2), Audio (U23.40)
NetR18_2: MCU (R18.2), Peripherals (R265.2 R276.1 T7.2)
NetR24_1: MCU (R24.1), Peripherals (R317.1)
NetR26_1: MCU (R26.1), Peripherals (R306.1)
NetR28_1: MCU (R28.1), Peripherals (R325.1)
NetR30_1: MCU (R30.1), Peripherals (R305.1)
NetR32_1: MCU (R32.1), CAN&Humidity_Sensor&HB_LED&IR (R256.2 R257.1)
NetR36_2: MCU (R36.2), Touch Sensing (R137.1 SB11.2)
NetR38_2: MCU (R38.2), Touch Sensing (R103.1 SB9.2)
NetR39_1: MCU (R39.1), MotorCtrl (R96.1)
NetR42_1: MCU (R42.1), Touch Sensing (R104.1 SB6.2)
NetR44_1: MCU (R44.1), Touch Sensing (R122.2)
NetR50_1: MCU (R50.1), CAN&Humidity_Sensor&HB_LED&IR (R159.2)
NetR52_1: MCU (R52.1), Audio (U23.38)
NetR54_1: MCU (R54.1), Audio (U23.36)
NetR56_1: MCU (R56.1), Audio (U23.39)
NetR58_1: MCU (R58.1), LCD_MicroSD_Flash (R314.2 U28.1)
NetR111_1: MCU (R111.1), Peripherals (R313.2)
NetR129_1: MCU (R129.1), RS232_RS485_IrDA (R186.1 U8.3)
PA1: MCU (CN7.44 U4.24), MotorCtrl (R74.1)
PA2: MCU (CN7.43 U4.25), MotorCtrl (C37.1 R115.1)
PA3: MCU (CN7.42 U4.26), MotorCtrl (C37.2 R114.2 R115.2)
PA5: MCU (CN7.38 U4.30), MotorCtrl (PG3SA.5 PGM2.6 PGM2.9)
PA6: MCU (CN7.37 U4.31), MotorCtrl (C33.1 R118.1)
PA7: MCU (CN7.36 U4.32), MotorCtrl (R75.1)
PA8: MCU (CN6.6 JP1.1 U4.67), Audio (R237.1)
PA10: MB1019 (JP5.2 R182.2 R183.2), MCU (CN6.7 U4.69)
PA11: MCU (CN6.9 U4.70), Peripherals (R266.1)
PA12: MCU (CN6.12 U4.71), Peripherals (R260.1)
PA13: MCU (CN6.13 U4.72), JTAG&Trace (RS1.13), ST_LINK (U13.7 U15.27)
PA14: MCU (CN6.16 U4.76), JTAG&Trace (RS1.11), ST_LINK (U15.15 U15.26)
PA15: MCU (CN6.17 U4.77), JTAG&Trace (RS1.7), ST_LINK (U15.17)
PB1: MCU (CN7.32 U4.36), MotorCtrl (C29.1 R135.1)
PB2: MCU (CN7.31 R21.1 U4.37), Power (R245.1)
PB3: MCU (CN6.32 U4.89), JTAG&Trace (RS1.9), ST_LINK (U13.6)
PB4: MCU (CN6.31 U4.90), JTAG&Trace (RS1.5), ST_LINK (U15.19)
PB5: MCU (CN6.34 U4.91), Peripherals (R307.2)
PB6: MCU (CN6.33 U4.92), MotorCtrl (C35.2 CN4.31 JP7.1)
PB7: MCU (CN6.36 U4.93), MotorCtrl (R79.2)
PB9: MCU (CN6.38 U4.96), CAN&Humidity_Sensor&HB_LED&IR (R262.2)
PB10: MCU (CN7.16 U4.47), MotorCtrl (C21.2 R130.2 R131.2)
PB13: MCU (CN7.15 U4.52), MotorCtrl (R110.1)
PB14: MCU (CN7.14 U4.53), LCD_MicroSD_Flash (R299.1)
PB15: MCU (CN7.13 U4.54), LCD_MicroSD_Flash (R310.2)
PC0: MCU (CN7.51 U4.15), MotorCtrl (R85.2)
PC2: MCU (CN7.48 U4.17), MotorCtrl (R84.1)
PC3: MCU (CN7.47 U4.18), MotorCtrl (R77.1)
PC4: MCU (CN7.35 U4.33), RS232_RS485_IrDA (R177.2)
PC5: MCU (CN7.34 U4.34), MotorCtrl (C33.2 R117.2 R118.2)
PC7: MCU (CN6.3 U4.64), MotorCtrl (CN4.7)
PC9: MCU (CN6.5 U4.66), Audio (R247.2)
PC13: MCU (R187.1 U4.7), Peripherals (R308.2)
PD0: MCU (CN6.21 U4.81), CAN&Humidity_Sensor&HB_LED&IR (R124.1)
PD1: MCU (CN6.24 U4.82), CAN&Humidity_Sensor&HB_LED&IR (R105.2)
PD3: MCU (CN6.26 U4.84), MotorCtrl (C10.2 CN2.31 JP2.1)
PD4: MCU (CN6.25 U4.85), MotorCtrl (C12.2 CN2.33)
PD5: MCU (CN6.28 U4.86), Peripherals (R22.1)
PD6: MCU (CN6.27 U4.87), Peripherals (R12.1)
PD10: MCU (CN7.8 U4.57), MotorCtrl (R100.1)
PD11: MCU (CN7.5 U4.58), MotorCtrl (R92.1)
PE0: MCU (CN6.37 U4.97), LCD_MicroSD_Flash (R250.1)
PE1: MCU (CN6.40 U4.98), RS232_RS485_IrDA (JP13.2 JP13.4 JP13.6)
PE6: MCU (CN6.46 R111.2 U4.5), JTAG&Trace (CN9.20)
PE7: MCU (CN7.29 U4.38), Peripherals (R309.2)
PE12: MCU (CN7.21 U4.43), MotorCtrl (CN2.13)
PE14: MCU (CN7.18 U4.45), I2C Peripherals (R136.1), LCD_MicroSD_Flash (R140.2)
PF6: MB1019 (JP6.2 R179.2 R180.2), MCU (CN6.14 U4.73)
PF9: MCU (CN6.45 U4.10), LCD_MicroSD_Flash (R303.2)
PF10: MCU (CN6.47 U4.11), MotorCtrl (CN4.23)
RESET#: MCU (6 pins), JTAG&Trace (RS1.3), ST_LINK (U15.18), Audio (R304.2), LCD_MicroSD_Flash (TR3.1)